# Altium schematic sheet Camera.SchDoc
size A3; Author: Швецов С.В.; Organization: PapuaSoft; SheetNumber: 7; SheetTotal: 8
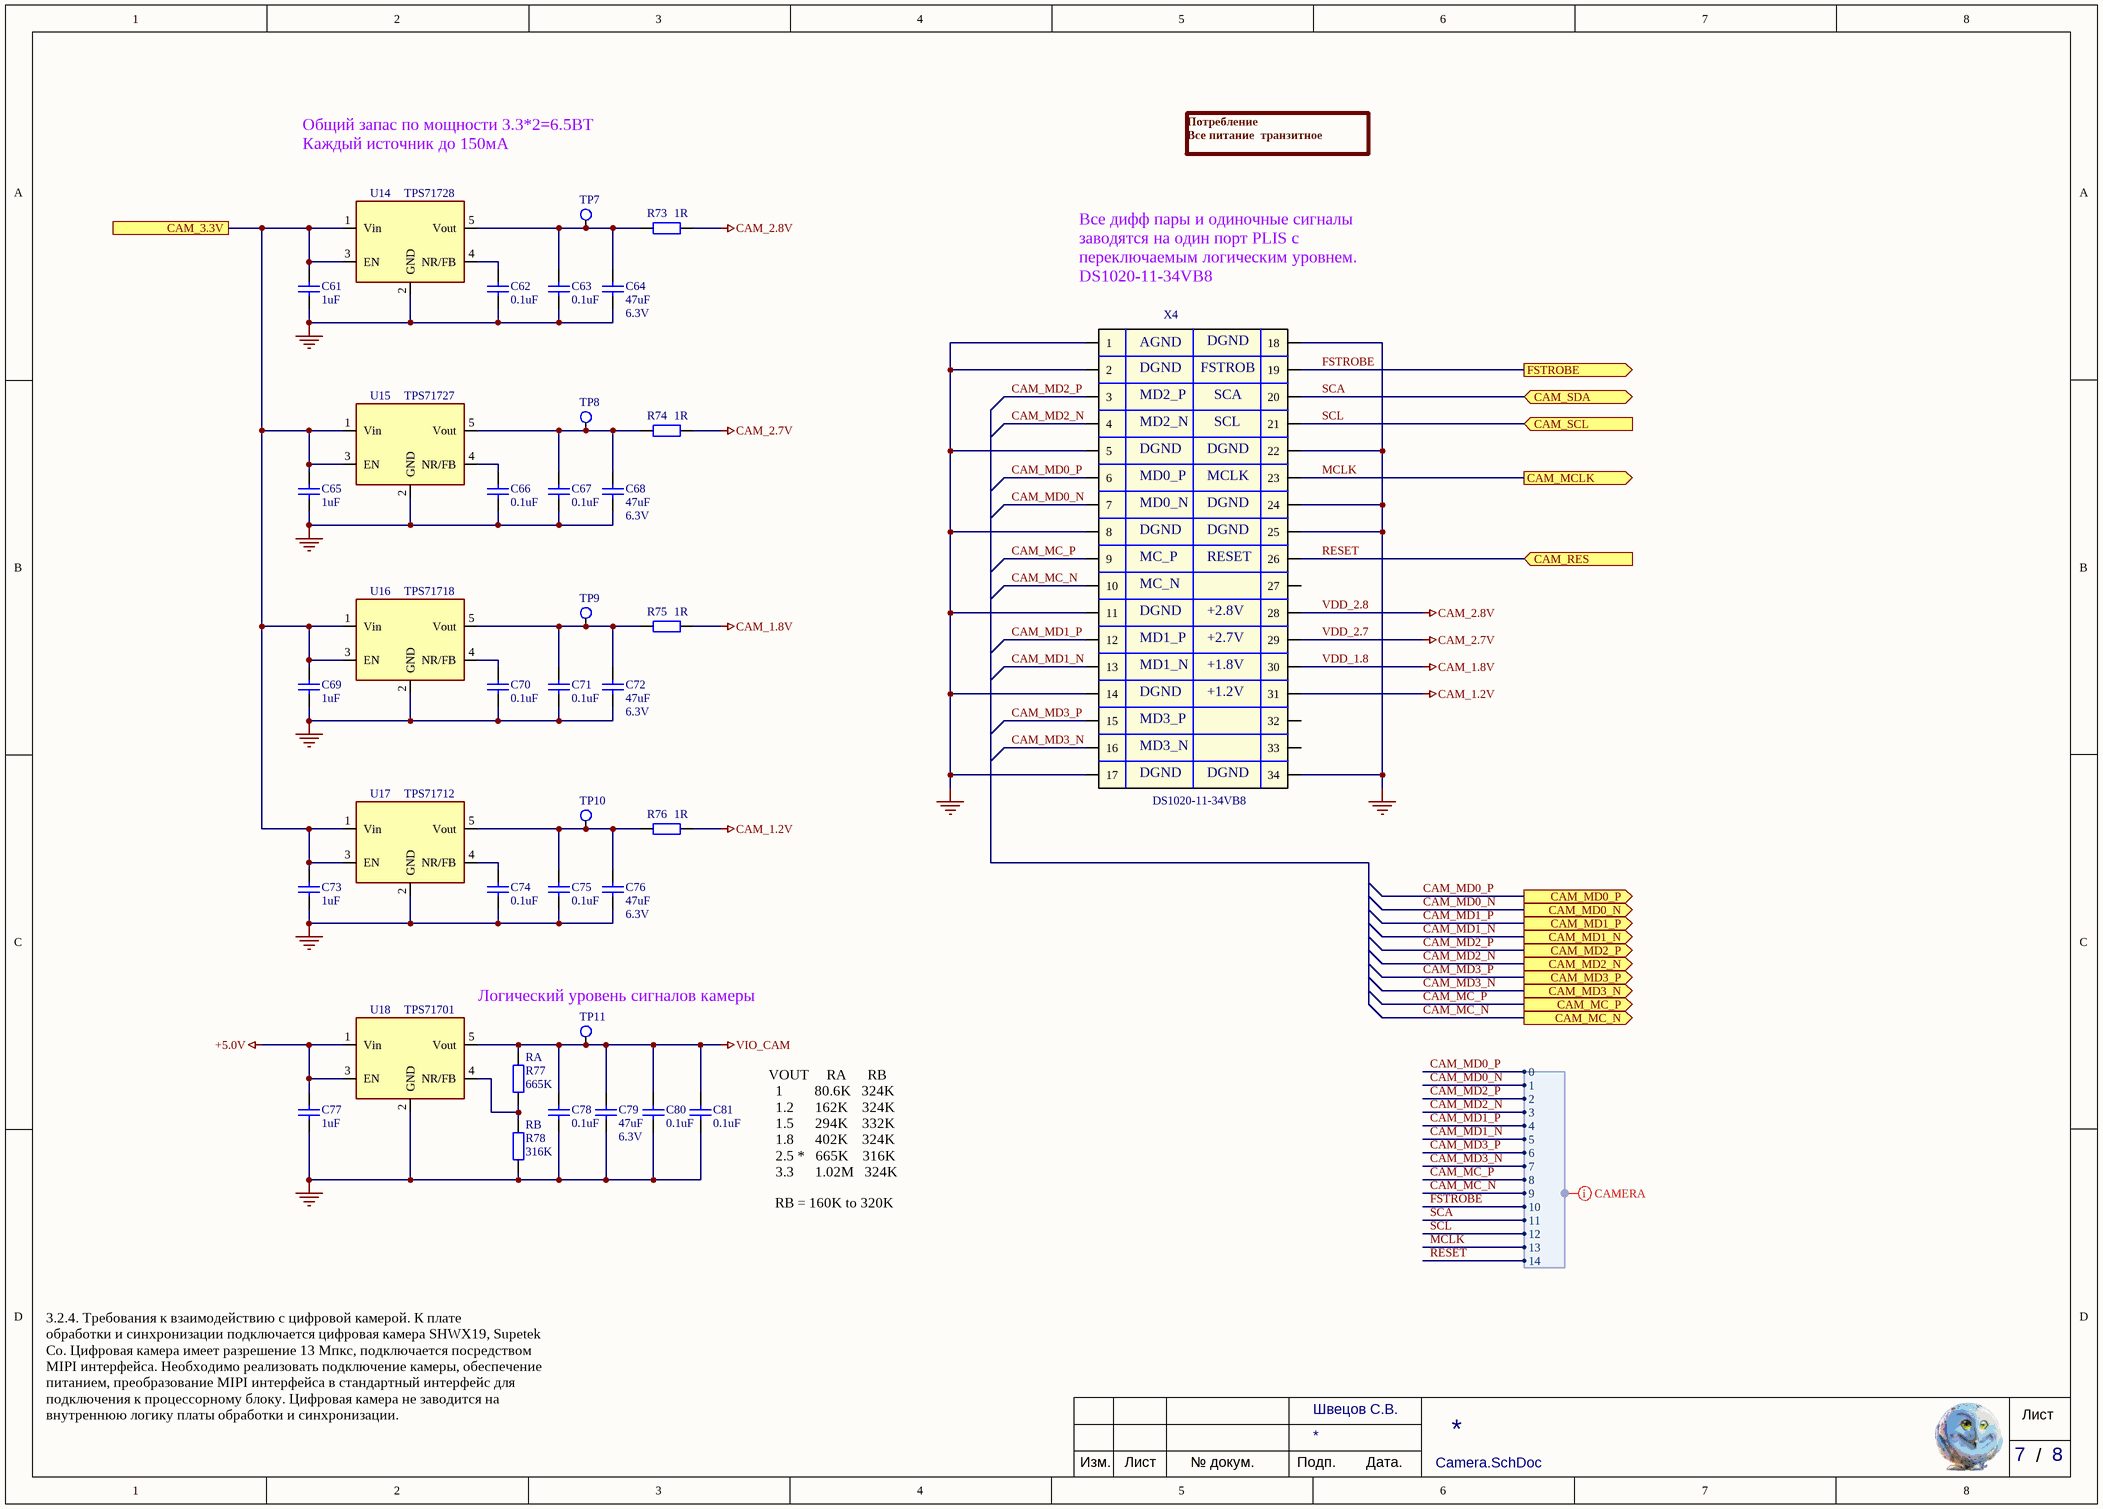
[diagram p0: Camera.SchDoc]

## Parts
C61  value 1uF  [C0603]  (hidden comment: Cap)
C62  value 0.1uF  [C0402]  (hidden comment: Cap)
C63  value 0.1uF  [C0402]  (hidden comment: Cap)
C64  value 47uF  Voltage: 6.3V  [C0805]  (hidden comment: Cap)
C65  value 1uF  [C0603]  (hidden comment: Cap)
C66  value 0.1uF  [C0402]  (hidden comment: Cap)
C67  value 0.1uF  [C0402]  (hidden comment: Cap)
C68  value 47uF  Voltage: 6.3V  [C0805]  (hidden comment: Cap)
C69  value 1uF  [C0603]  (hidden comment: Cap)
C70  value 0.1uF  [C0402]  (hidden comment: Cap)
C71  value 0.1uF  [C0402]  (hidden comment: Cap)
C72  value 47uF  Voltage: 6.3V  [C0805]  (hidden comment: Cap)
C73  value 1uF  [C0603]  (hidden comment: Cap)
C74  value 0.1uF  [C0402]  (hidden comment: Cap)
C75  value 0.1uF  [C0402]  (hidden comment: Cap)
C76  value 47uF  Voltage: 6.3V  [C0805]  (hidden comment: Cap)
C77  value 1uF  [C0603]  (hidden comment: Cap)
C78  value 0.1uF  [C0402]  (hidden comment: Cap)
C79  value 47uF  Voltage: 6.3V  [C0805]  (hidden comment: Cap)
C80  value 0.1uF  [C0402]  (hidden comment: Cap)
C81  value 0.1uF  [C0402]  (hidden comment: Cap)
R73  value 1R  [R0402]  (hidden comment: Res2)
R74  value 1R  [R0402]  (hidden comment: Res2)
R75  value 1R  [R0402]  (hidden comment: Res2)
R76  value 1R  [R0402]  (hidden comment: Res2)
R77  value 665K  Parameter 1: RA  [R0402]  (hidden comment: Res2)
R78  value 316K  Parameter 1: RB  [R0402]  (hidden comment: Res2)
TP7  (no value)  [TP_0MM5_1MM0]  (no BOM)
TP8  (no value)  [TP_0MM5_1MM0]  (no BOM)
TP9  (no value)  [TP_0MM5_1MM0]  (no BOM)
TP10  (no value)  [TP_0MM5_1MM0]  (no BOM)
TP11  (no value)  [TP_0MM5_1MM0]  (no BOM)
U14  value TPS71728  [SOT23_5]
U15  value TPS71727  [SOT23_5]
U16  value TPS71718  [SOT23_5]
U17  value TPS71712  [SOT23_5]
U18  value TPS71701  [SOT23_5]
X4  DS1020-11-34VB8  [DS1020-11-34VB8]

## Ports
CAM_3.3V, CAM_MC_N (out), CAM_MC_P (out), CAM_MCLK (out), CAM_MD0_N (out), CAM_MD0_P (out), CAM_MD1_N (out), CAM_MD1_P (out), CAM_MD2_N (out), CAM_MD2_P (out), CAM_MD3_N (out), CAM_MD3_P (out), CAM_RES (in), CAM_SCL (in), CAM_SDA (bidir), FSTROBE (out)

## Harnesses
CAMERA: 0, 1, 2, 3, 4, 5, 6, 7, 8, 9, 11, 12, 10, 13, 14

## Nets
+5.0V: C77.1 U18.1(Vin) U18.3(EN)
CAM_1.2V: R76.1 X4.31
GND: C61.2 C62.2 C63.2 C64.2 C65.2 C66.2 C67.2 C68.2 C69.2 C70.2 C71.2 C72.2 C73.2 C74.2 C75.2 C76.2 C77.2 C78.2 C79.2 C80.2 C81.2 R78.2 U14.2(GND) U15.2(GND) U16.2(GND) U17.2(GND) U18.2(GND) X4.1 X4.2 X4.5 X4.8 X4.11 X4.14 X4.17 X4.18 X4.22 X4.24 X4.25 X4.34
VDD_1.8: R75.1 X4.30  [also labelled CAM_1.8V]
VDD_2.7: R74.1 X4.29  [also labelled CAM_2.7V]
VDD_2.8: R73.1 X4.28  [also labelled CAM_2.8V]
VIO_CAM: C78.1 C79.1 C80.1 C81.1 R77.1 TP11.1(e1) U18.5(Vout)
CAM_3.3V: C61.1 C65.1 C69.1 C73.1 U14.1(Vin) U14.3(EN) U15.1(Vin) U15.3(EN) U16.1(Vin) U16.3(EN) U17.1(Vin) U17.3(EN) ; port CAM_3.3V
CAM_MC_N: X4.10 ; port CAM_MC_N, harness CAMERA.9
CAM_MC_P: X4.9 ; port CAM_MC_P, harness CAMERA.8
CAM_MD0_N: X4.7 ; port CAM_MD0_N, harness CAMERA.1
CAM_MD0_P: X4.6 ; port CAM_MD0_P, harness CAMERA.0
CAM_MD1_N: X4.13 ; port CAM_MD1_N, harness CAMERA.5
CAM_MD1_P: X4.12 ; port CAM_MD1_P, harness CAMERA.4
CAM_MD2_N: X4.4 ; port CAM_MD2_N, harness CAMERA.3
CAM_MD2_P: X4.3 ; port CAM_MD2_P, harness CAMERA.2
CAM_MD3_N: X4.16 ; port CAM_MD3_N, harness CAMERA.7
CAM_MD3_P: X4.15 ; port CAM_MD3_P, harness CAMERA.6
FSTROBE: X4.19 ; port FSTROBE, harness CAMERA.10
MCLK: X4.23 ; port CAM_MCLK, harness CAMERA.13
RESET: X4.26 ; port CAM_RES, harness CAMERA.14
SCA: X4.20 ; port CAM_SDA, harness CAMERA.11
SCL: X4.21 ; port CAM_SCL, harness CAMERA.12
NetC62_1: C62.1 U14.4(NR/FB)
NetC63_1: C63.1 C64.1 R73.2 TP7.1(e1) U14.5(Vout)
NetC66_1: C66.1 U15.4(NR/FB)
NetC67_1: C67.1 C68.1 R74.2 TP8.1(e1) U15.5(Vout)
NetC70_1: C70.1 U16.4(NR/FB)
NetC71_1: C71.1 C72.1 R75.2 TP9.1(e1) U16.5(Vout)
NetC74_1: C74.1 U17.4(NR/FB)
NetC75_1: C75.1 C76.1 R76.2 TP10.1(e1) U17.5(Vout)
NetR77_2: R77.2 R78.1 U18.4(NR/FB)

Not connected (* = marked no-connect by the designer): X4 27 32 33

## Layout directives
net class CAMERA: (no net found under the mark)

## Notes on the sheet
- Общий запас по мощности 3.3*2=6.5ВТ
  Каждый источник до 150мА
- Потребление
  Все питание  транзитное
- (near X4) Все дифф пары и одиночные сигналы заводятся на один порт PLIS с переключаемым логическим уровнем.
  DS1020-11-34VB8
- (near X4) AGND
- (near X4) DGND
- (near X4) FSTROB
- (near X4) MD2_P
- (near X4) MD2_N
- (near X4) SCA
- (near X4) SCL
- (near X4) MD0_P
- (near X4) MD0_N
- (near X4) MCLK
- (near X4) MC_P
- (near X4) MC_N
- (near X4) RESET
- (near X4) MD1_P
- (near X4) +2.7V
- (near X4) +2.8V
- (near X4) MD1_N
- (near X4) MD3_P
- (near X4) +1.8V
- (near X4) +1.2V
- (near X4) MD3_N
- (near TP11) Логический уровень сигналов камеры
- VOUT     RA      RB
  1         80.6K   324K
  1.2      162K    324K
  1.5      294K    332K
  1.8      402K    324K
  2.5 *   665K    316K
  3.3      1.02M   324K
- RB = 160K to 320K
- 3.2.4. Требования к взаимодействию с цифровой камерой. К плате
  обработки и синхронизации подключается цифровая камера SHWX19, Supetek
  Co. Цифровая камера имеет разрешение 13 Мпкс, подключается посредством
  MIPI интерфейса. Необходимо реализовать подключение камеры, обеспечение
  питанием, преобразование MIPI интерфейса в стандартный интерфейс для
  подключения к процессорному блоку. Цифровая камера не заводится на
  внутреннюю логику платы обработки и синхронизации.
- Лист
- /
- Изм.
- № докум.
- Подп.
- Дата.

## Library data of the parts
C61 C65 C69 C73 C77 = Cap: Конденсатор керамический; PackageReference: 0603; ClassName: CAM_POWER
C62 C63 C66 C67 C70 C71 C74 C75 C78 C80 C81 = Cap: Конденсатор керамический; Voltage: 25V; PackageReference: 0402; ClassName: CAM_POWER
C64 C68 C72 C76 C79 = Cap: C0805C476M9PAC; PackageReference: 0805; ClassName: CAM_POWER
R73-R78 = Res2: Резистор; PackageReference: 0402; ClassName: CAM_POWER
TP7 = Test_Point: Тестовая точка на плате; MarkPCB: +2.8V; ClassName: CAM_POWER
TP8 = Test_Point: Тестовая точка на плате; MarkPCB: +2.7V; ClassName: CAM_POWER
TP9 = Test_Point: Тестовая точка на плате; MarkPCB: +1.8V; ClassName: CAM_POWER
TP10 TP11 = Test_Point: Тестовая точка на плате; MarkPCB: +1.2V; ClassName: CAM_POWER
U14 = TPS71701: Линейный стабилизатор +2.8В; PackageReference: SC70-5; ClassName: CAM_POWER; Parameter 1: *
U15 = TPS71701: Линейный стабилизатор +2.7В; PackageReference: SC70-5; ClassName: CAM_POWER; Parameter 1: *
U16 = TPS71701: Линейный стабилизатор +1.8В; PackageReference: SC70-5; ClassName: CAM_POWER; Parameter 1: *
U17 U18 = TPS71701: Линейный стабилизатор +1.2В; PackageReference: SC70-5; ClassName: CAM_POWER; Parameter 1: *
X4 = CON2x16: Розетка  Kyocera; Value: DS1020-11-34VB8; ClassName: *